# Altium schematic sheet relay_sch.SchDoc
size A4; SheetNumber: 1; SheetTotal: 1; SPICEModelCacheTWZFFHXA: <root> / <DocumentId>TWZFFHXA</DocumentId> / <CacheFrame Number="0"> / <Model Name="1n4004" Kind="MDL"> / <Text>*1N4004 MCE 8-16-95 / *400V 1A Si GenPurpose Diode pkg:DIODE0.4 1,2 / .MODEL 1N4004 D(IS=2.55E-9 RS=0.042 N=1.75 TT=5.76E-6 CJO=1.85E-11 / + VJ=0.75 M=0.333 BV=400 IBV=3.95E-5 )</Text> / </Model> / </CacheFrame> / </root>
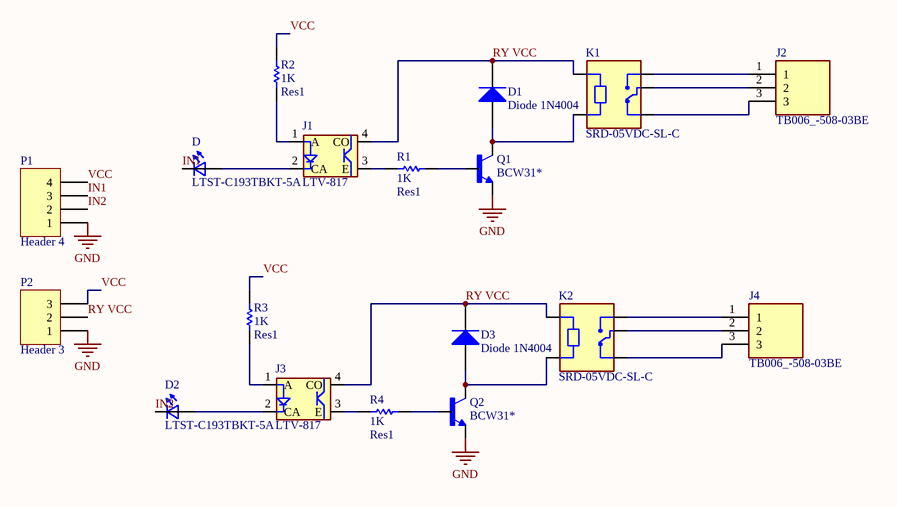
[diagram p0: relay_sch.SchDoc]

## Parts
D  LTST-C193TBKT-5A  [0603]
D1  Diode 1N4004  [DO-41]
D2  LTST-C193TBKT-5A  [0603]
D3  Diode 1N4004  [DO-41]
J1  LTV-817  [LTV-817]
J2  TB006_-508-03BE  [CUI_TB006 -508-03BE]
J3  LTV-817  [LTV-817]
J4  TB006_-508-03BE  [CUI_TB006 -508-03BE]
K1  SRD-05VDC-SL-C  [RELAY_SRD-05VDC-SL-C]
K2  SRD-05VDC-SL-C  [RELAY_SRD-05VDC-SL-C]
P1  Header 4  [HDR1X4]
P2  Header 3  [HDR1X3]
Q1  BCW31*  [SOT23-BEC]
Q2  BCW31*  [SOT23-BEC]
R1  Res1  value 1K  [AXIAL-0.3]
R2  Res1  value 1K  [AXIAL-0.3]
R3  Res1  value 1K  [AXIAL-0.3]
R4  Res1  value 1K  [AXIAL-0.3]

## Nets
GND: P1.1 P2.1 Q1.E Q2.E
IN1: D.1(K2) P1.3
IN2: D2.1(K2) P1.2
RY VCC: D1.2(K) D3.2(K) J1.4(CO) J3.4(CO) K1.A1 K2.A1 P2.2
VCC: P1.4 P2.3 R2.2 R3.2
NetD1_1: D1.1(A) K1.A2 Q1.C
NetD2_2: D2.2(A2) J3.2(CA)
NetD3_1: D3.1(A) K2.A2 Q2.C
NetD_2: D.2(A2) J1.2(CA)
NetJ1_1: J1.1(A) R2.1
NetJ1_3: J1.3(E) R1.1
NetJ2_1: J2.1 K1.NO
NetJ2_2: J2.2 K1.COM
NetJ2_3: J2.3 K1.NC
NetJ3_1: J3.1(A) R3.1
NetJ3_3: J3.3(E) R4.1
NetJ4_1: J4.1 K2.NO
NetJ4_2: J4.2 K2.COM
NetJ4_3: J4.3 K2.NC
NetQ1_B: Q1.B R1.2
NetQ2_B: Q2.B R4.2

## Library data of the parts
D D2 = LTST-C193TBKT-5A: Blue 470nm LED Indication - Discrete 2.8V 0603 _1608 Metric_; MF: Lite-On Inc.; MP: LTST-C193TBKT-5A; Value: *; Digi-Key_Purchase_URL: https://www.digikey.com/product-detail/en/lite-on-inc/LTST-C193TBKT-5A/160-1827-1-ND/2355044?utm_source=snapeda&utm_medium=aggregator&utm_campaign=symbol; SnapEDA_Link: https://www.snapeda.com/parts/LTST-C193TBKT-5A/Lite-On%20Inc./view-part/350303/?ref=snap; Digi-Key_Part_Number: 160-1827-1-ND; Package: 0603 Lite-On
D1 D3 = Diode 1N4004: 1 Amp General Purpose Rectifier; Published: 8-Jun-2000; LatestRevisionDate: 17-Jul-2002; LatestRevisionNote: Re-released for DXP Platform.; DatasheetVersion: 1998; PackageVersion: Aug-1999; PackageReference: DO-41; Publisher: Altium Limited; PackageDescription: Diode, Axial; Body 5.2 x 2.7 mm (LxDia. max), Lead Dia. 0.86 mm (max); Code_JEDEC: DO-204-AL; ComponentLink1Description: Manufacturer Link; ComponentLink1URL: http://www.fairchildsemi.com/; ComponentLink2Description: Datasheet; ComponentLink2URL: http://www.fairchildsemi.com/ds/1N%2F1N4001.pdf
J1 J3 = LTV-817: Optoisolator Transistor Output 5000Vrms 1 Channel 4-DIP; MF: Lite-On Inc.; Price: None; Value: *; MP: LTV-817; Purchase-URL: https://pricing.snapeda.com/search/part/LTV-817/?ref=eda; Package: DIP-4 Lite-On; Check_prices: https://www.snapeda.com/parts/LTV-817/Lite-On%20Inc./view-part/92982/?ref=eda; SnapEDA_Link: https://www.snapeda.com/parts/LTV-817/Lite-On%20Inc./view-part/92982/?ref=snap; Availability: In Stock
J2 J4 = TB006_-508-03BE: 2~24 Poles, Screw Type, Horizontal, 5.08 Pitch, 26~14 (AWG), Terminal Block Connector; MF: CUI Devices; MP: TB006 -508-03BE; Purchase-URL: https://pricing.snapeda.com/search/part/TB006 -508-03BE/?ref=eda; Package: None; Check_prices: https://www.snapeda.com/parts/TB006%20-508-03BE/CUI+Devices/view-part/?ref=eda; Value: *; CUI_purchase_URL: https://www.cuidevices.com/product/interconnect/connectors/terminal-blocks/tb006-508-series?utm_source=snapeda.com&utm_medium=referral&utm_campaign=snapedaBOM; SnapEDA_Link: https://www.snapeda.com/parts/TB006%20-508-03BE/CUI+Devices/view-part/?ref=snap; Availability: In Stock; Price: None
K1 K2 = SRD-05VDC-SL-C: 5V Trigger Relay Module For Arduino And Raspberry Pi 5V Trigger Relay Module For Arduino And Raspberry Pi; MF: Songle Relay; Check_prices: https://www.snapeda.com/parts/SRD-05VDC-SL-C/Songle+Relay/view-part/?ref=eda; Value: *; Availability: Not in stock; Price: None; Package: NON STANDARD-5 Songle Relay; MP: SRD-05VDC-SL-C; SnapEDA_Link: https://www.snapeda.com/parts/SRD-05VDC-SL-C/Songle+Relay/view-part/?ref=snap
P1 = Header 4: Header, 4-Pin; LatestRevisionDate: 17-Jul-2002; LatestRevisionNote: Re-released for DXP Platform.; Publisher: Altium Limited
P2 = Header 3: Header, 3-Pin; LatestRevisionDate: 17-Jul-2002; LatestRevisionNote: Re-released for DXP Platform.; Publisher: Altium Limited
Q1 Q2 = BCW31*: â€¢ This device is designed for general purpose amplifier applications at collector currents to 300 mA. â€¢ Sourced from process 10.; MF: Fairchild Semiconductor; MP: BCW31; SnapEDA_Link: https://www.snapeda.com/parts/BCW31/Fairchild+Imaging/view-part/?ref=snap; Package: SOT-23 Diodes Inc.; Value: *; Check_prices: https://www.snapeda.com/parts/BCW31/Fairchild+Imaging/view-part/?ref=eda
R1-R4 = Res1: Resistor; Published: 8-Jun-2000; LatestRevisionDate: 17-Jul-2002; LatestRevisionNote: Re-released for DXP Platform.; PackageReference: AXIAL-0.3; Publisher: Altium Limited; PackageDescription: Axial Device, Thru-Hole; 2 Leads; 0.3 in Pin Spacing